# EAGLE design Laser_scanner_schematic (EAGLE 9.6.2)
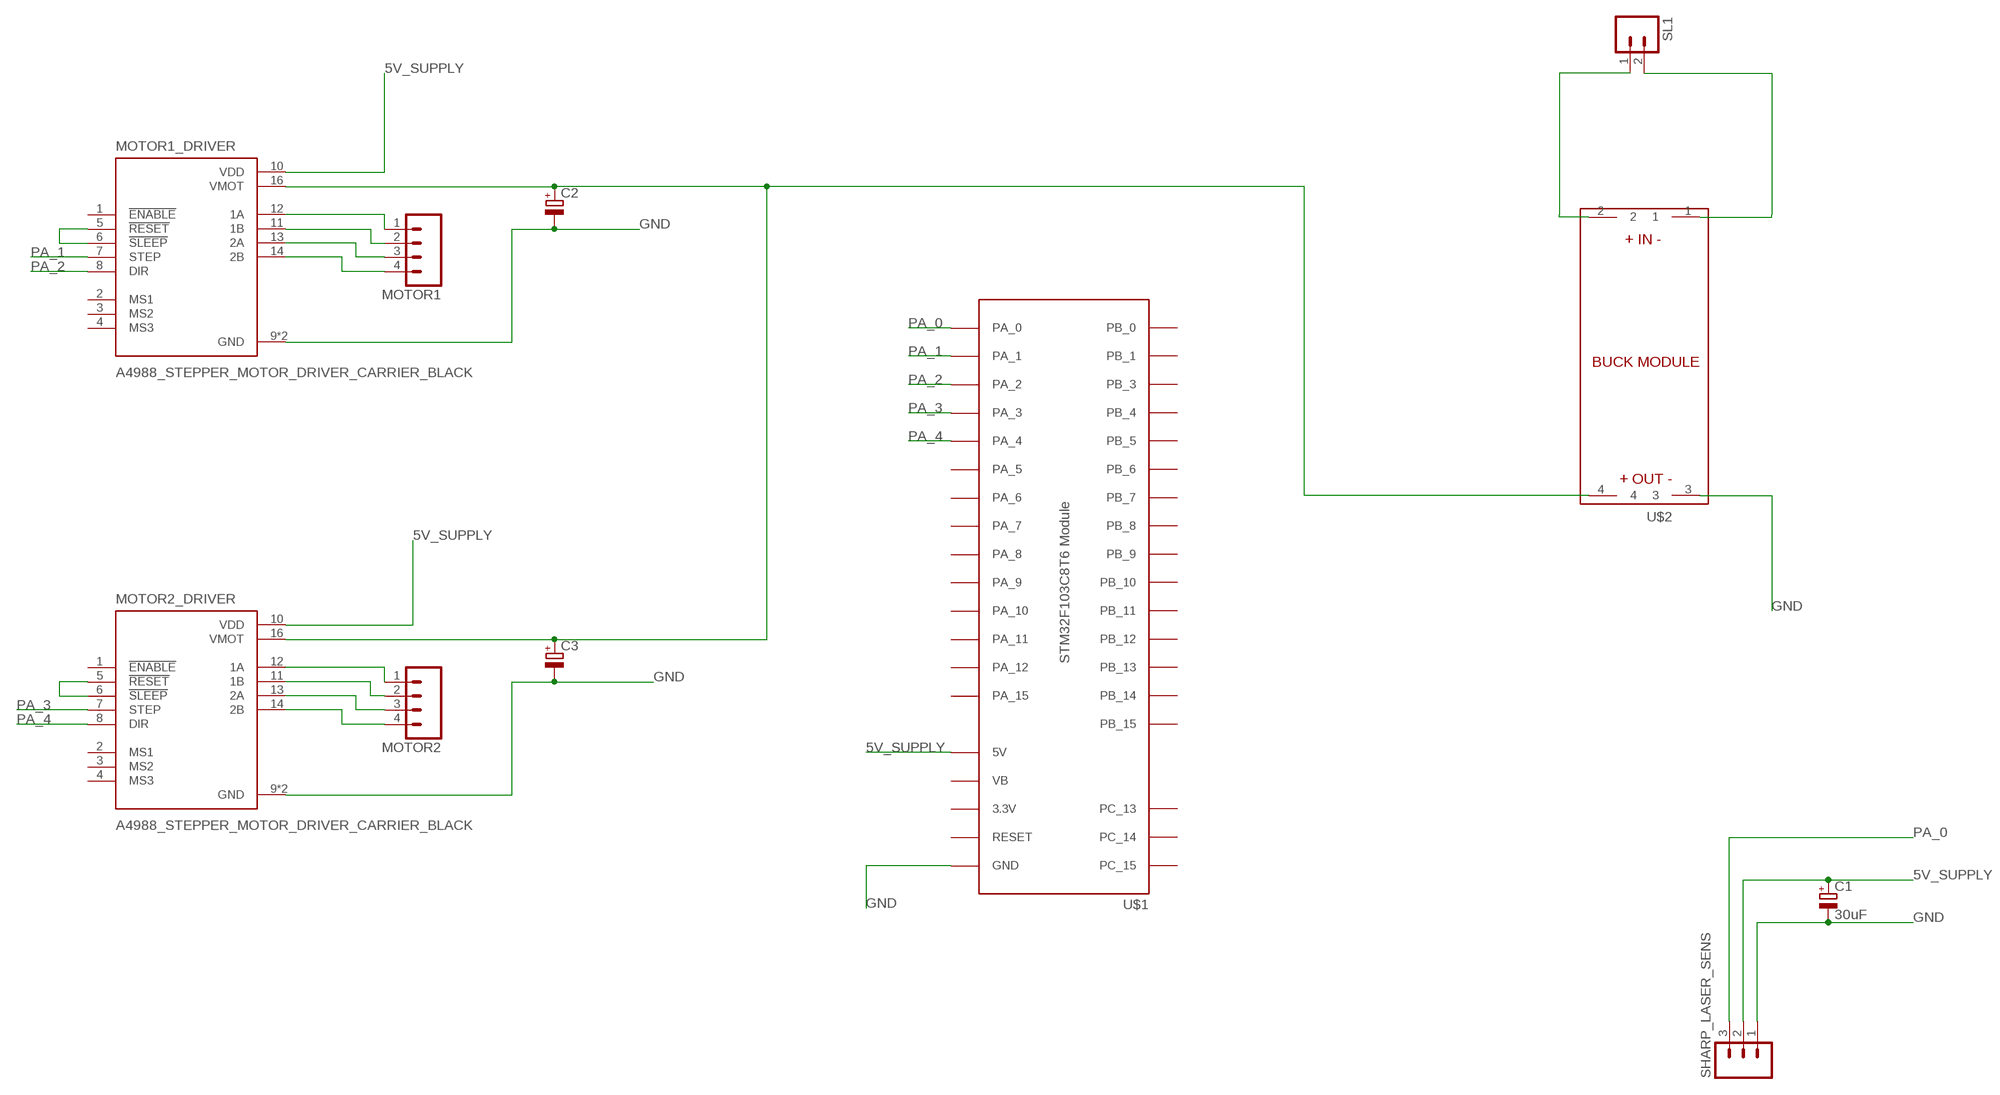
[diagram p0: schematic, sheet 1]

## Parts
C1  30uF  CPOL-EUE2-4  [E2-4]
C2  CPOL-EUE2-5  [E2-5]
C3  CPOL-EUE2-5  [E2-5]
MOTOR1  M04  [04P]
MOTOR1_DRIVER  A4988_STEPPER_MOTOR_DRIVER_CARRIER_BLACK  [MODULE_A4988_STEPPER_MOTOR_DRIVER_CARRIER_BLACK]
MOTOR2  M04  [04P]
MOTOR2_DRIVER  A4988_STEPPER_MOTOR_DRIVER_CARRIER_BLACK  [MODULE_A4988_STEPPER_MOTOR_DRIVER_CARRIER_BLACK]
SHARP_LASER_SENS  M03  [03P]
SL1  M02  [02P]
U$1  STM32F103C8T6-MODULE  [STM32F103C8T6-MODULE]
U$2  BUCK_MODULEWITH_SMDPADS&THROUGHHOLES  [BUCK_MODULE]

## Nets
5V_SUPPLY: C1.+ MOTOR1_DRIVER.10(VDD) MOTOR2_DRIVER.10(VDD) SHARP_LASER_SENS.2 U$1.5V
GND: C1.- C2.- C3.- MOTOR1_DRIVER.9(GND) MOTOR1_DRIVER.15(GND) MOTOR2_DRIVER.9(GND) MOTOR2_DRIVER.15(GND) SHARP_LASER_SENS.1 U$1.GND@1(GND) U$1.GND@2(GND) U$1.GND@3(GND) U$2.3
N$1: MOTOR1.1 MOTOR1_DRIVER.12(1A)
N$2: MOTOR1.2 MOTOR1_DRIVER.11(1B)
N$3: MOTOR1_DRIVER.5(!RESET) MOTOR1_DRIVER.6(!SLEEP)
N$4: MOTOR2_DRIVER.5(!RESET) MOTOR2_DRIVER.6(!SLEEP)
N$5: MOTOR1.3 MOTOR1_DRIVER.13(2A)
N$6: MOTOR1.4 MOTOR1_DRIVER.14(2B)
N$7: MOTOR2.1 MOTOR2_DRIVER.12(1A)
N$8: MOTOR2.2 MOTOR2_DRIVER.11(1B)
N$9: MOTOR2.3 MOTOR2_DRIVER.13(2A)
N$10: MOTOR2.4 MOTOR2_DRIVER.14(2B)
N$11: SL1.1 U$2.2
N$12: SL1.2 U$2.1
N$13: C2.+ C3.+ MOTOR1_DRIVER.16(VMOT) MOTOR2_DRIVER.16(VMOT) U$2.4
PA_0: SHARP_LASER_SENS.3 U$1.PA_0
PA_1: MOTOR1_DRIVER.7(STEP) U$1.PA_1
PA_2: MOTOR1_DRIVER.8(DIR) U$1.PA_2
PA_3: MOTOR2_DRIVER.7(STEP) U$1.PA_3
PA_4: MOTOR2_DRIVER.8(DIR) U$1.PA_4
Unconnected: MOTOR1_DRIVER.1(!ENABLE) MOTOR1_DRIVER.2(MS1) MOTOR1_DRIVER.3(MS2) MOTOR1_DRIVER.4(MS3) MOTOR2_DRIVER.1(!ENABLE) MOTOR2_DRIVER.2(MS1) MOTOR2_DRIVER.3(MS2) MOTOR2_DRIVER.4(MS3) U$1.3.3V@1(3.3V) U$1.3.3V@2(3.3V) U$1.PA_5 U$1.PA_6 U$1.PA_7 U$1.PA_8 U$1.PA_9 U$1.PA_10 U$1.PA_11 U$1.PA_12 U$1.PA_15 U$1.PB_0 U$1.PB_1 U$1.PB_3 U$1.PB_4 U$1.PB_5 U$1.PB_6 U$1.PB_7 U$1.PB_8 U$1.PB_9 U$1.PB_10 U$1.PB_11 U$1.PB_12 U$1.PB_13 U$1.PB_14 U$1.PB_15 U$1.PC_13 U$1.PC_14 U$1.PC_15 U$1.RESET U$1.VB

## Library data of the parts
C1-C3 = rcl:CPOL-EU: POLARIZED CAPACITOR, European symbol; SPICEPREFIX: C
MOTOR1 MOTOR2 = con-amp-quick:M04: AMP QUICK CONNECTOR; OC_FARNELL: unknown; OC_NEWARK: unknown
MOTOR1_DRIVER MOTOR2_DRIVER = A4988_STEPPER_MOTOR_DRIVER_CARRIER_BLACK:A4988_STEPPER_MOTOR_DRIVER_CARRIER_BLACK: Stepper motor controler; IC: A4988; 1A; Uin mot: 8÷35V Check availability <https://pricing.snapeda.com/parts/A4988%20STEPPER%20MOTOR%20DRIVER%20CARRIER%20BLACK/Pololu/view-part?ref=eda>; AVAILABILITY: Not in stock; DESCRIPTION: Stepper motor controler; IC: A4988; 1.2A; Uin mot: 8÷35V; MF: Pololu; MP: A4988 STEPPER MOTOR DRIVER CARRIER BLACK; PACKAGE: None; PRICE: None
SHARP_LASER_SENS = con-amp-quick:M03: AMP QUICK CONNECTOR; OC_FARNELL: unknown; OC_NEWARK: unknown
SL1 = con-amp-quick:M02: AMP QUICK CONNECTOR; OC_FARNELL: unknown; OC_NEWARK: unknown
U$1 = bluepill_eagle_lib:STM32F103C8T6-MODULE: STM32F103C8T6 module with ARM Cortex-3, 20kB SRAM, 64kB Flash, 72MHz
U$2 = BUCK_MODULE:BUCK_MODULE

## Board
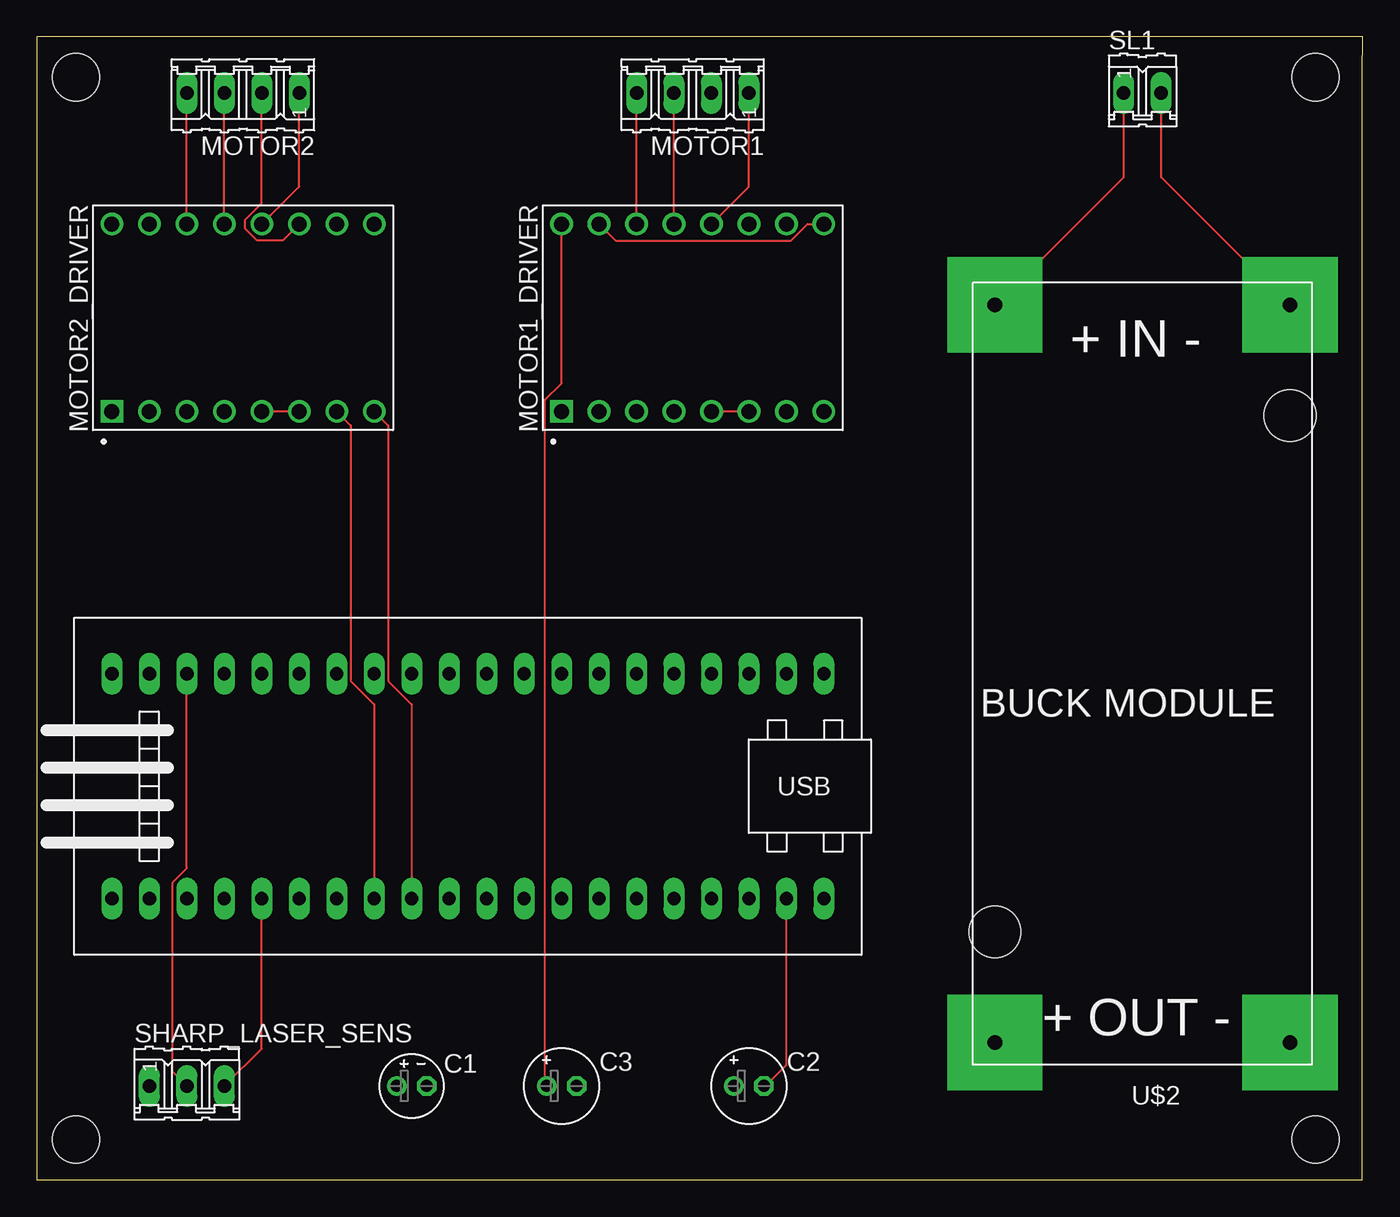
[diagram p1: board, top side]
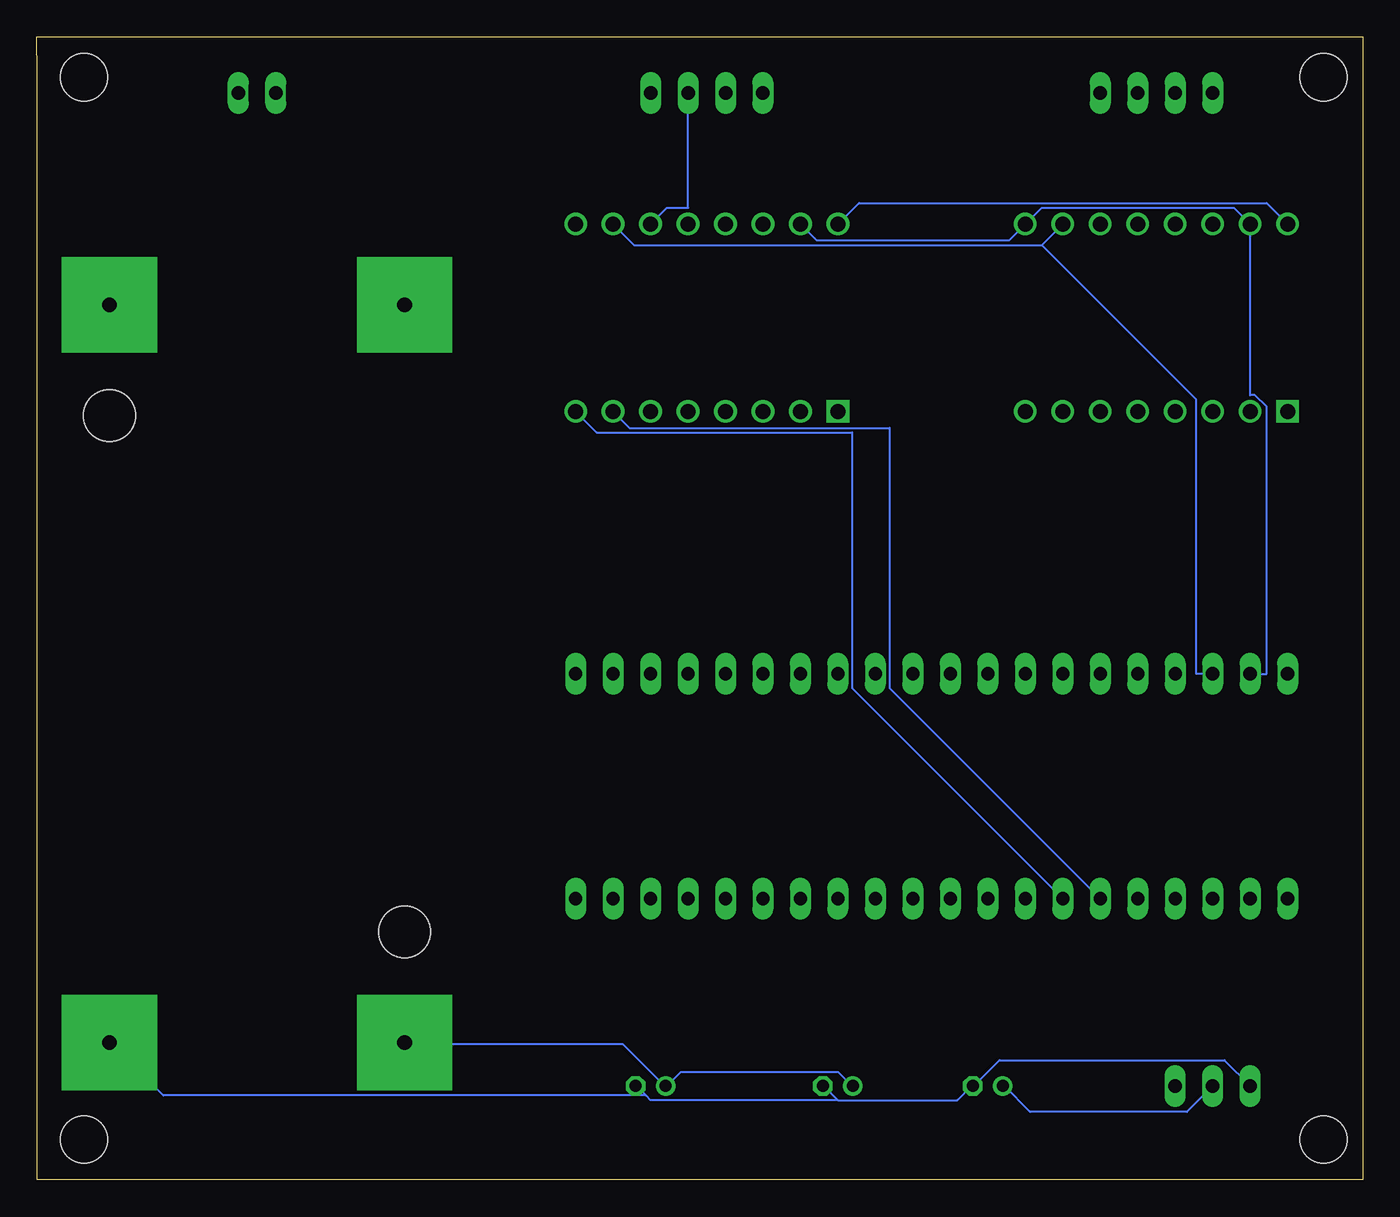
[diagram p2: board, bottom side, seen from below]

Size 89.85 x 77.46 mm. Coordinates in mm from the lower left corner, seen from the top.
Outline: 0,77.46 0,0 89.84,0 89.84,74.93 89.85,77.46 0,77.46
Copper layers (1*16): Top 0.035mm / dielectric 1.5mm / Bottom 0.035mm
Design rules "default": minimum track width 6mil, minimum drill 0.35mm, track to track 6mil, track to pad 6mil, pad to pad 6mil, via to via 6mil, smd to smd 6mil, copper to edge 40mil, drill to drill 6mil, minimum pad ring 10mil, minimum via ring 8mil, stop-mask expansion 4mil, vias tented up to drill 0mil, thermal gap 10mil
Holes 3.2 mm at 2.65,74.73 2.65,2.73 86.65,2.73 86.65,74.73

### Footprints (pad centres in the part's own frame; a part is rotated, then mirrored left to right if it is on the bottom)
E2-4 = drill 0.813 pad 1.27: + -1.016,0 | drill 0.813 pad 1.27 octagon: - 1.016,0
E2-5 = drill 0.813 pad 1.27: + -1.016,0 | drill 0.813 pad 1.27 octagon: - 1.016,0
04P = drill 0.914 long: 1 -3.81,0; 2 -1.27,0; 3 1.27,0; 4 3.81,0
MODULE_A4988_STEPPER_MOTOR_DRIVER_CARRIER_BLACK = drill 1.02 square: 1 -6.35,8.89 | drill 1.02: 2 -6.35,6.35; 3 -6.35,3.81; 4 -6.35,1.27; 5 -6.35,-1.27; 6 -6.35,-3.81; 7 -6.35,-6.35; 8 -6.35,-8.89; 9 6.35,-8.89; 10 6.35,-6.35; 11 6.35,-3.81; 12 6.35,-1.27; 13 6.35,1.27; 14 6.35,3.81; 15 6.35,6.35; 16 6.35,8.89
03P = drill 0.914 long: 1 -2.54,0; 2 0,0; 3 2.54,0
02P = drill 0.914 long: 1 -1.27,0; 2 1.27,0
STM32F103C8T6-MODULE = drill 0.9 long: 3.3V@1 25.4,-7.62; 3.3V@2 -17.78,7.62; 5V 20.32,-7.62; GND@1 22.86,-7.62; GND@2 -20.32,7.62; GND@3 -22.86,7.62; PA_0 15.24,7.62; PA_1 12.7,7.62; PA_2 10.16,7.62; PA_3 7.62,7.62; PA_4 5.08,7.62; PA_5 2.54,7.62; PA_6 0,7.62; PA_7 -2.54,7.62; PA_8 -12.7,-7.62; PA_9 -10.16,-7.62; PA_10 -7.62,-7.62; PA_11 -5.08,-7.62; PA_12 -2.54,-7.62; PA_15 0,-7.62; PB_0 -5.08,7.62; PB_1 -7.62,7.62; PB_3 2.54,-7.62; PB_4 5.08,-7.62; PB_5 7.62,-7.62; PB_6 10.16,-7.62; PB_7 12.7,-7.62; PB_8 15.24,-7.62; PB_9 17.78,-7.62; PB_10 -10.16,7.62; PB_11 -12.7,7.62; PB_12 -22.86,-7.62; PB_13 -20.32,-7.62; PB_14 -17.78,-7.62; PB_15 -15.24,-7.62; PC_13 22.86,7.62; PC_14 20.32,7.62; PC_15 17.78,7.62; RESET -15.24,7.62; VB 25.4,7.62
BUCK_MODULE = drill 1 pad 6.452 square: 1 -10,-25; 2 10,-25; 3 -10,25; 4 10,25 | hole 3.5: -10,-17.5; 10,17.5

### Placement (x,y rotation side)
C1  25.4,6.35 0 top
C2  48.26,6.35 0 top
C3  35.56,6.35 0 top
MOTOR1  44.45,73.66 180 top
MOTOR1_DRIVER  44.45,58.42 90 top
MOTOR2  13.97,73.66 180 top
MOTOR2_DRIVER  13.97,58.42 90 top
SHARP_LASER_SENS  10.16,6.35 0 top
SL1  74.93,73.66 0 top
U$1  30.48,26.67 180 top
U$2  74.93,34.29 180 top

### Tracks (layer width: path | path; a pad name or v marks a point on that pad's centre or on a via)
5V_SUPPLY
  Top 0.152: U$1.5V 10.16,21.11 9.21,20.16 9.21,7.3 SHARP_LASER_SENS.2
  Bottom 0.152: 21.75,63.34 MOTOR2_DRIVER.10 | 21.75,63.34 49.37,63.34 MOTOR1_DRIVER.10 | SHARP_LASER_SENS.2 11.91,4.6 22.54,4.6 24.29,6.35 C1.+ | 21.75,63.34 11.27,52.86 11.27,34.29 U$1.5V
GND
  Top 0.152: MOTOR1_DRIVER.9 52.23,64.77 51.12,63.66 39.21,63.66 MOTOR1_DRIVER.15 | U$1.GND@2 50.8,7.78 49.37,6.35 C2.-
  Bottom 0.152: MOTOR1_DRIVER.15 36.99,63.66 23.97,63.66 MOTOR2_DRIVER.9 21.75,65.88 8.73,65.88 MOTOR2_DRIVER.15 7.62,53.18 7.3,53.18 6.51,52.39 6.51,34.29 U$1.GND@1 | 35.56,5.4 27.46,5.4 26.51,6.35 C1.- 26.35,6.35 24.61,8.1 9.37,8.1 SHARP_LASER_SENS.1 | 35.56,5.4 36.51,6.35 C3.- | 48.58,5.71 48.26,5.4 35.56,5.4 | 48.58,5.71 49.21,6.35 C2.- | 48.58,5.71 81.28,5.71 84.77,9.21 U$2.3
N$1
  Top 0.152: MOTOR1.1 48.26,67.31 MOTOR1_DRIVER.12
N$2
  Bottom 0.152: MOTOR1.2 45.72,65.88 47.15,65.88 MOTOR1_DRIVER.11
N$3
  Top 0.152: MOTOR1_DRIVER.6 MOTOR1_DRIVER.5
N$4
  Top 0.152: MOTOR2_DRIVER.6 MOTOR2_DRIVER.5
N$5
  Top 0.152: MOTOR1_DRIVER.13 MOTOR1.3
N$6
  Top 0.152: MOTOR1_DRIVER.14 MOTOR1.4
N$7
  Top 0.152: MOTOR2.1 17.78,67.31 MOTOR2_DRIVER.12
N$8
  Top 0.152: MOTOR2.2 15.24,66.2 14.13,65.09 14.13,64.45 14.92,63.66 16.67,63.66 MOTOR2_DRIVER.11
N$9
  Top 0.152: MOTOR2_DRIVER.13 MOTOR2.3
N$10
  Top 0.152: MOTOR2_DRIVER.14 MOTOR2.4
N$11
  Top 0.152: SL1.1 73.66,67.95 65.09,59.37 U$2.2
N$12
  Top 0.152: SL1.2 76.2,67.95 84.77,59.37 U$2.1
N$13
  Top 0.152: MOTOR1_DRIVER.16 35.56,53.97 34.45,52.86 34.45,6.35 C3.+
  Bottom 0.152: MOTOR2_DRIVER.16 6.51,66.2 34.13,66.2 MOTOR1_DRIVER.16 | C3.+ 34.61,6.35 35.56,7.3 46.2,7.3 47.15,6.35 C2.+ 47.31,6.35 50.16,9.21 64.93,9.21 U$2.4
PA_0
  Top 0.152: U$1.PA_0 15.24,8.89 SHARP_LASER_SENS.3
PA_1
  Bottom 0.152: U$1.PA_1 32.07,33.34 32.07,50.96 49.69,50.96 MOTOR1_DRIVER.7
PA_2
  Bottom 0.152: U$1.PA_2 34.61,33.34 34.61,50.64 51.91,50.64 MOTOR1_DRIVER.8
PA_3
  Top 0.152: U$1.PA_3 22.86,32.23 21.27,33.81 21.27,51.12 MOTOR2_DRIVER.7
PA_4
  Top 0.152: U$1.PA_4 25.4,32.23 23.81,33.81 23.81,51.12 MOTOR2_DRIVER.8